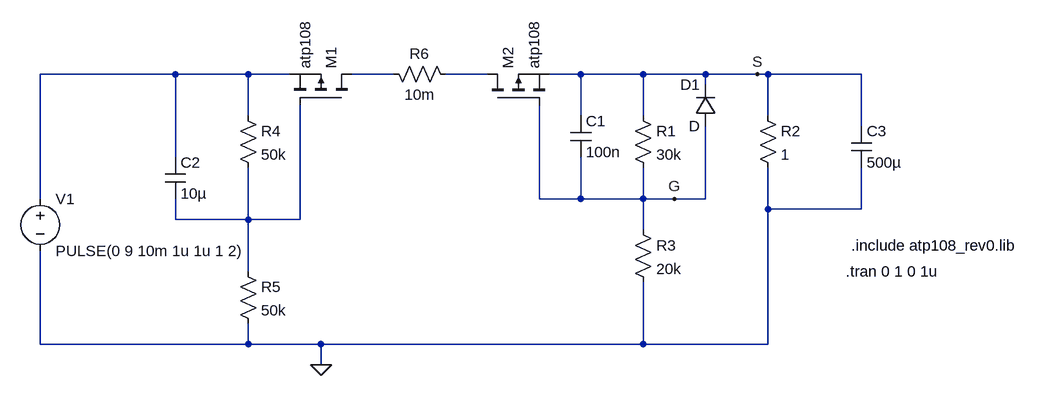
[diagram p0: schematic strombegrenzung_cb.asc]
strombegrenzung_cb.asc, the LTspice schematic file:
Version 4
SHEET 1 880 680
WIRE -640 16 -848 16
WIRE -528 16 -640 16
WIRE -464 16 -528 16
WIRE -304 16 -368 16
WIRE -160 16 -224 16
WIRE -16 16 -64 16
WIRE 80 16 -16 16
WIRE 176 16 80 16
WIRE 256 16 176 16
WIRE 272 16 256 16
WIRE 416 16 272 16
WIRE 176 32 176 16
WIRE -528 80 -528 16
WIRE -16 80 -16 16
WIRE 80 80 80 16
WIRE 272 80 272 16
WIRE 416 96 416 16
WIRE -640 144 -640 16
WIRE -848 208 -848 16
WIRE -80 208 -80 64
WIRE -16 208 -16 144
WIRE -16 208 -80 208
WIRE 80 208 80 160
WIRE 80 208 -16 208
WIRE 128 208 80 208
WIRE 176 208 176 96
WIRE 176 208 128 208
WIRE 272 224 272 160
WIRE 416 224 416 160
WIRE 416 224 272 224
WIRE -640 240 -640 208
WIRE -528 240 -528 160
WIRE -528 240 -640 240
WIRE -448 240 -448 64
WIRE -448 240 -528 240
WIRE 80 256 80 208
WIRE -528 320 -528 240
WIRE -848 432 -848 288
WIRE -528 432 -528 400
WIRE -528 432 -848 432
WIRE -416 432 -528 432
WIRE 80 432 80 336
WIRE 80 432 -416 432
WIRE 272 432 272 224
WIRE 272 432 80 432
WIRE -416 464 -416 432
FLAG 256 16 S
FLAG 128 208 G
FLAG -416 464 0
SYMBOL voltage -848 192 R0
WINDOW 123 0 0 Left 0
WINDOW 39 0 0 Left 0
SYMATTR InstName V1
SYMATTR Value PULSE(0 9 10m 1u 1u 1 2)
SYMBOL res 256 64 R0
SYMATTR InstName R2
SYMATTR Value 1
SYMBOL res 64 64 R0
SYMATTR InstName R1
SYMATTR Value 30k
SYMBOL res 64 240 R0
SYMATTR InstName R3
SYMATTR Value 20k
SYMBOL diode 192 96 R180
WINDOW 0 24 64 Left 2
WINDOW 3 24 0 Left 2
SYMATTR InstName D1
SYMBOL cap -32 80 R0
SYMATTR InstName C1
SYMATTR Value 100n
SYMBOL cap -656 144 R0
SYMATTR InstName C2
SYMATTR Value 10µ
SYMBOL res -544 64 R0
SYMATTR InstName R4
SYMATTR Value 50k
SYMBOL res -544 304 R0
SYMATTR InstName R5
SYMATTR Value 50k
SYMBOL pmos -368 64 M270
SYMATTR InstName M1
SYMATTR Value atp108
SYMATTR Prefix X
SYMBOL pmos -160 64 R270
SYMATTR InstName M2
SYMATTR Value atp108
SYMATTR Prefix X
SYMBOL cap 400 96 R0
SYMATTR InstName C3
SYMATTR Value 500µ
SYMBOL res -320 0 M90
WINDOW 0 0 56 VBottom 2
WINDOW 3 32 56 VTop 2
SYMATTR InstName R6
SYMATTR Value 10m
TEXT 392 320 Left 2 !.tran 0 1 0 1u
TEXT 400 280 Left 2 !.include atp108_rev0.lib

The netlist it stands for:
* strombegrenzung_cb.asc
V1 N001 0 PULSE(0 9 10m 1u 1u 1 2)
R2 S 0 1
R1 S G 30k
R3 G 0 20k
D1 G S D
C1 S G 100n
C2 N001 N004 10µ
R4 N001 N004 50k
R5 N004 0 50k
XM1 N002 N004 N001 atp108  ; pins D G S
XM2 N003 G S atp108  ; pins D G S
C3 S 0 500µ
R6 N002 N003 10m
.model D D
.lib standard.dio
.tran 0 1 0 1u
.include atp108_rev0.lib
.backanno
.end

* Results of the author's LTspice run, read from the files saved beside the schematic
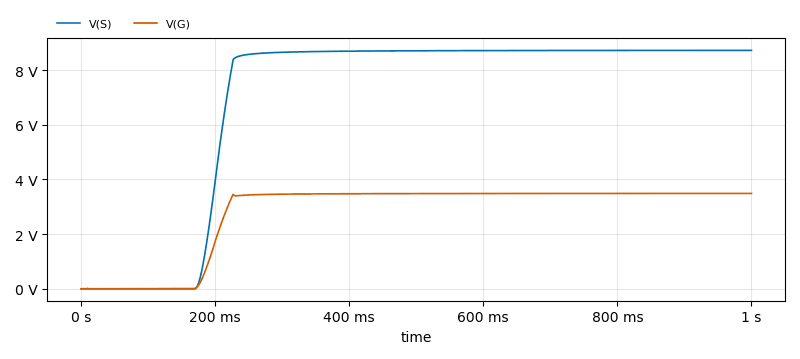
[diagram p1: Transient Analysis of strombegrenzung_cb.asc, plotted from the saved traces]
* Transient Analysis, 1 run:
*   V(S): min 0 V, max 8.721 V, average 6.938 V, rms 7.726 V, last 8.721 V
*   V(G): min -227.1 µV, max 3.488 V, average 2.782 V, rms 3.095 V, last 3.488 V